# Altium schematic sheet Powersupply.SchDoc
size A3; SheetNumber: 3; SheetTotal: 7
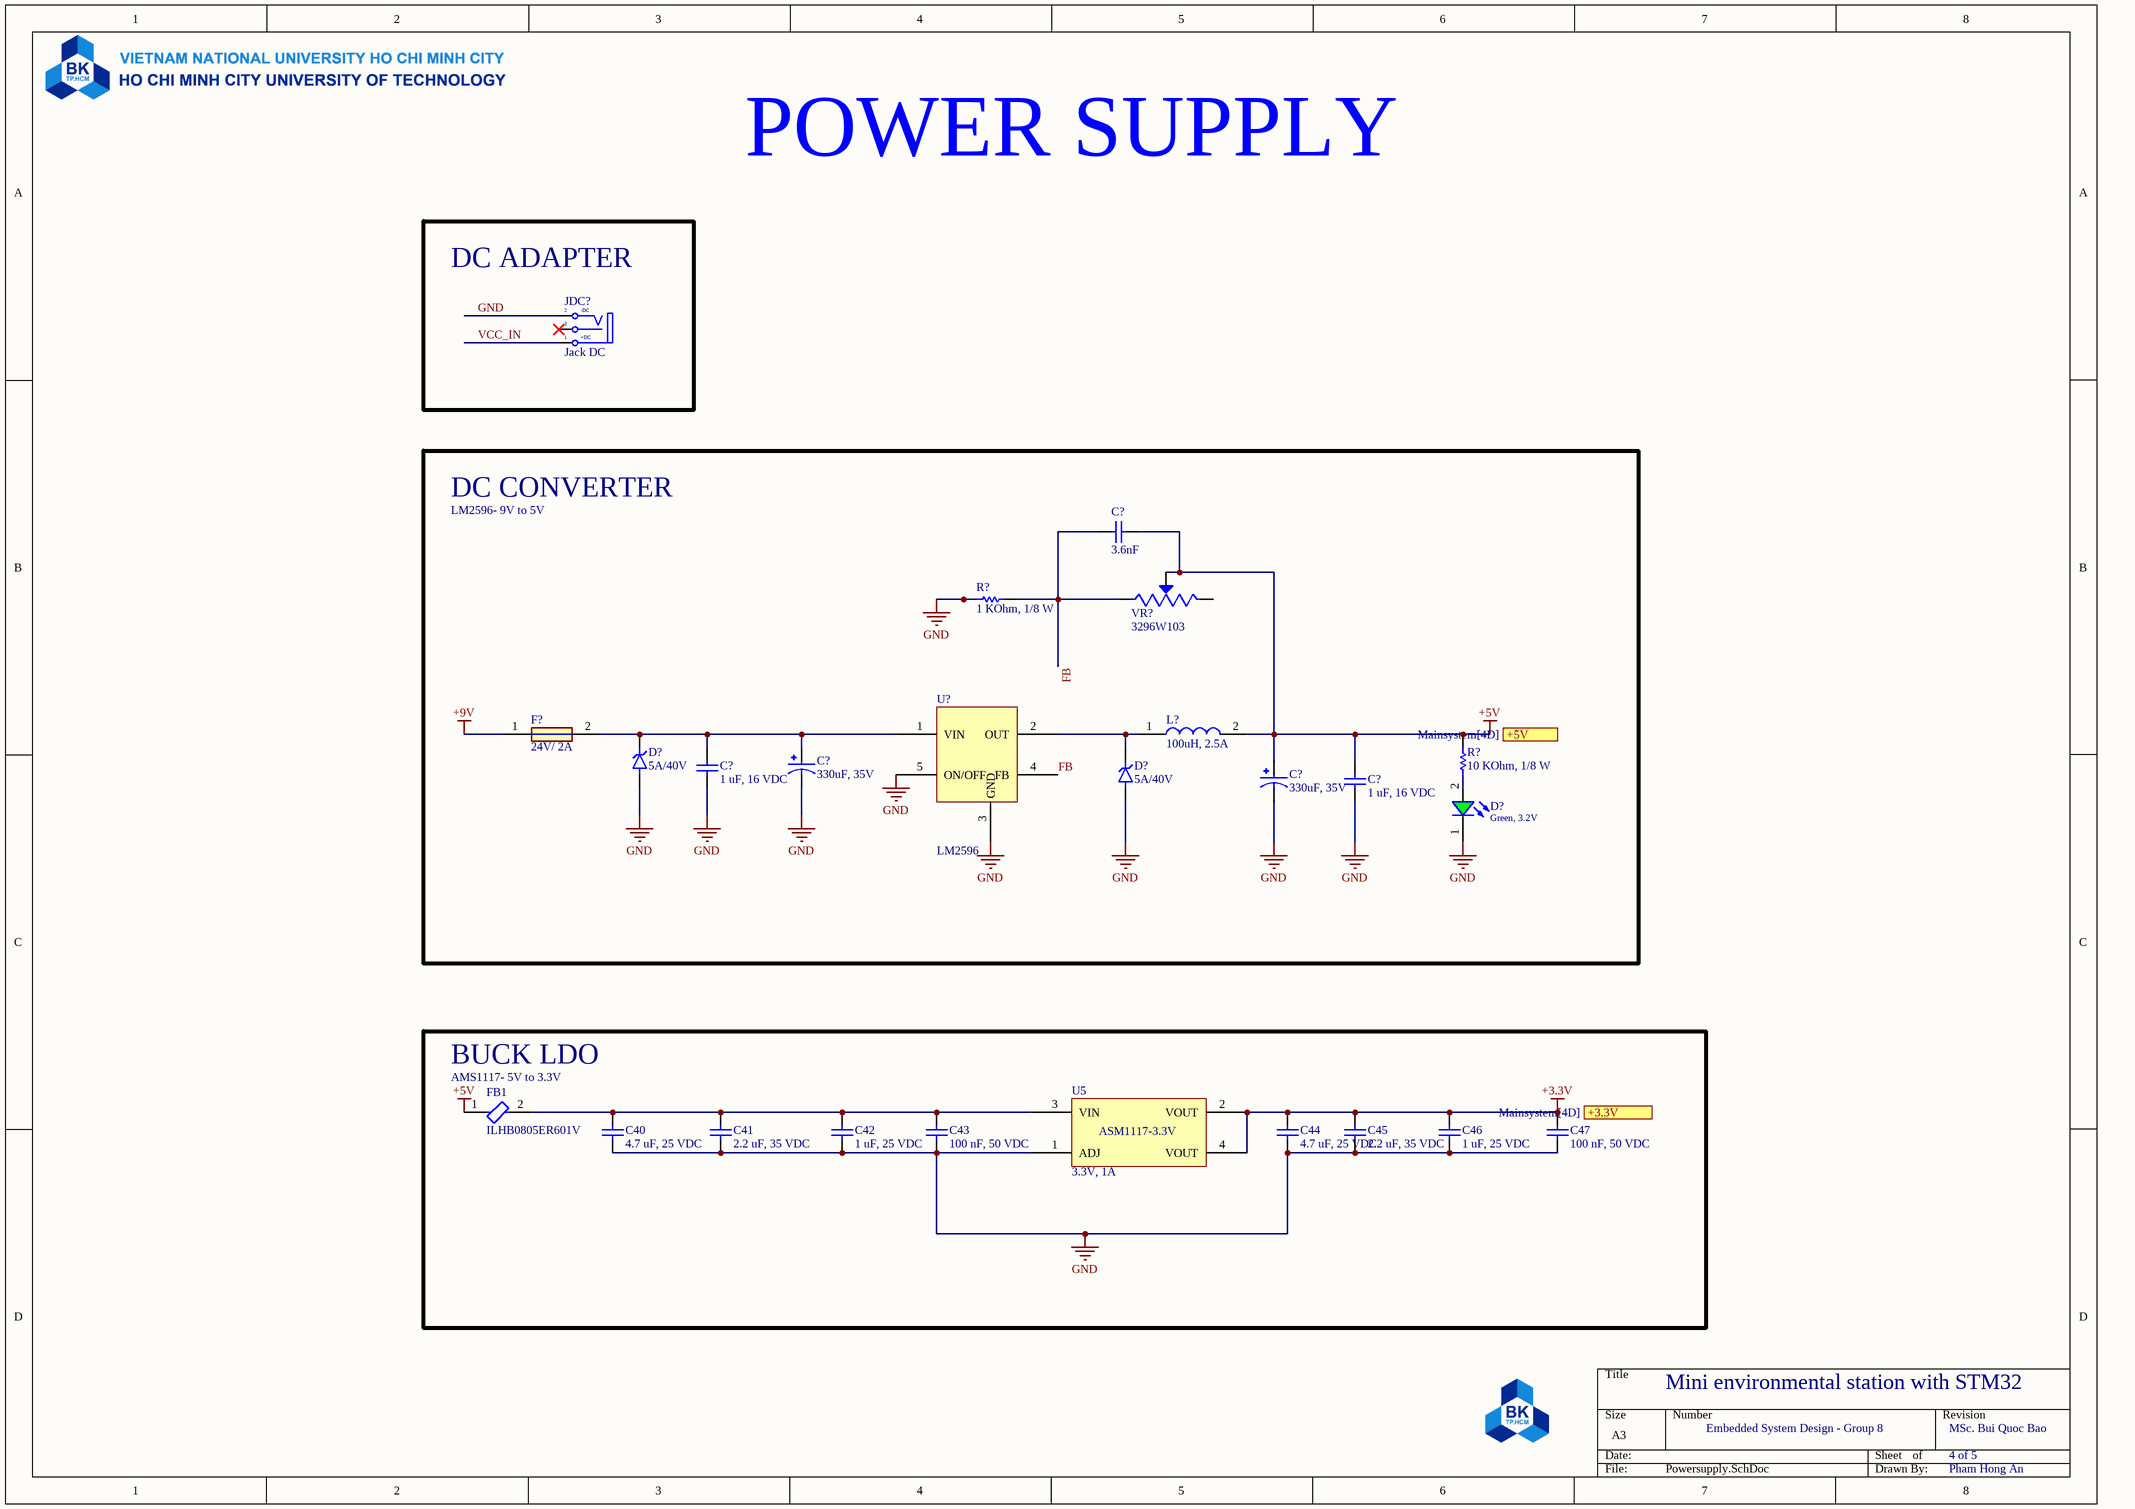
[diagram p0: Powersupply.SchDoc]

## Parts
(Parts that share a designator on the sheet are numbered #1, #2 ... from top to bottom, then left to right.)
C40  4.7 uF, 25 VDC  [CAP_0805]
C41  2.2 uF, 35 VDC  [CAP_0805]
C42  1 uF, 25 VDC  [CAP_0805]
C43  100 nF, 50 VDC  [CAP_0805]
C44  4.7 uF, 25 VDC  [CAP_0805]
C45  2.2 uF, 35 VDC  [CAP_0805]
C46  1 uF, 25 VDC  [CAP_0805]
C47  100 nF, 50 VDC  [CAP_0805]
C?#1  3.6nF  [CAP_0603]
C?#2  330uF, 35V  [CAP_EEEHA1E331P]
C?#3  330uF, 35V  [CAP_EEEHA1E331P]
C?#4  1 uF, 16 VDC  [CAP_0805]
C?#5  1 uF, 16 VDC  [CAP_0805]
D?#1  5A/40V  [DIOM4325X250N]
D?#2  5A/40V  [DIOM4325X250N]
D?#3  Green, 3.2V  [WL-SMCW_0805]
F?  24V/ 2A  [FUSC4632X85N]
FB1  ILHB0805ER601V  [FP-ILHB-0805-IPC_C]
JDC?  Jack DC  [DC-IN]
L?  100uH, 2.5A  [INDPM5656X320N]
R?#1  1 KOhm, 1/8 W  [RESISTOR_0805]
R?#2  10 KOhm, 1/8 W  [RESISTOR_0805]
U5  3.3V, 1A  [AMS1117-3.3V SOT223]
U?  LM2596  [LM2596]
VR?  3296W103  [TRIM_3296W103]

## Sub-sheets
BUCK LDO = AMS1117- 5V to 3.3V: no entries
DC ADAPTER = ?: no entries
DC CONVERTER = LM2596- 9V to 5V: no entries

## Ports
+3.3V (see Mainsystem[4D]), +5V (see Mainsystem[4D])

## Nets
+3.3V: C44.2 C45.2 C46.2 C47.2 U5.2(VOUT) U5.4(VOUT)
+5V: C?#1.2 C?#3.1 C?#5.2 FB1.1 L?.2 R?#2.2 VR?.2(WIPER)
+9V: F?.1
GND: C40.1 C41.1 C42.1 C43.1 C44.1 C45.1 C46.1 C47.1 C?#2.2 C?#3.2 C?#4.1 C?#5.1 D?#1.A D?#2.A D?#3.1(K) JDC?.2(TN) R?#1.1 U5.1(ADJ) U?.3(GND) U?.5(ON/OFF)
FB: C?#1.1 R?#1.2 U?.4(FB) VR?.1(CCW)
VCC_IN: JDC?.1(T)
NetC40_2: C40.2 C41.2 C42.2 C43.2 FB1.2 U5.3(VIN)
NetC?#2_1: C?#2.1 C?#4.2 D?#1.C(K) F?.2 U?.1(VIN)
NetD?#2_C: D?#2.C(K) L?.1 U?.2(OUT)
NetD?#3_2: D?#3.2(A) R?#2.1

Not connected (* = marked no-connect by the designer): JDC? 3(S)*; VR? 3(CW)

## Notes on the sheet
- POWER SUPPLY
- Mini environmental station with STM32
- Embedded System Design - Group 8
- MSc. Bui Quoc Bao
- 4 of 5
- Pham Hong An
- (in symbol AMS1117-3.3V) ASM1117-3.3V
- (in symbol CMP-002-00116-1) -DC; +DC

## Library data of the parts
C40 C44 = 0108054751025: CAP, size 0805, 4.7 uF, 25 VDC; Manufacture Name: TDK; Manufacture SN: CGA4J1X8L1E475K125AC; Capacitance: 4.7 uF; Tolerance: +/-10%; Voltage Rating DC: 25 VDC; ComponentLink2Description: Datasheet; ComponentLink2URL: https://product.tdk.com/system/files/dam/doc/product/capacitor/ceramic/mlcc/catalog/mlcc_automotive_hightemp_en.pdf?ref_disty=mouser; Operating Temperature: -55 to +125degC; Packaging: Tape and Reel; Mounting Technology: SMT; Size: 0805; Supplier 1 Name: Mouser; Supplier 1 SN: 810-CGA4J1X8L1E125AC; Supplier 1 URL: https://www.mouser.vn/ProductDetail/TDK/CGA4J1X8L1E475K125AC?qs=gZXFycFWdANxpKJOMQuJTA%3D%3D&utm_source=mouser-refine-download&utm_medium=file&utm_campaign=CGA4J1X8L1E475K125AC&utm_content=TDK; Supplier 2 Name: Digi-Key; Supplier 2 SN: 445-181605-2-ND; Supplier 2 URL: https://www.digikey.com/en/products/detail/tdk-corporation/cga4j1x8l1e475k125ac/9991390; Supplier 3 Name: thegioiic; Supplier 3 SN: OEM; Supplier 3 URL: N/A; Value: 4.7 uF, 25 VDC
C41 C45 = 0108052251035: CAP, size 0805, 2.2 uF, 35 VDC; Manufacture Name: TDK; Manufacture SN: CGA4J1X7R1V225K125AC; Capacitance: 2.2 uF; Tolerance: +/-10%; Voltage Rating DC: 35 VDC; ComponentLink2Description: Datasheet; ComponentLink2URL: https://product.tdk.com/system/files/dam/doc/product/capacitor/ceramic/mlcc/catalog/mlcc_automotive_general_en.pdf?ref_disty=mouser; Operating Temperature: -55 to +125degC; Packaging: Tape and Reel; Mounting Technology: SMT; Size: 0805; Supplier 1 Name: Mouser; Supplier 1 SN: 810-CGA4J1X7R1V225K; Supplier 1 URL: https://www.mouser.vn/ProductDetail/TDK/CGA4J1X7R1V225K125AC?qs=NRhsANhppD%2FTd0jz18r29g%3D%3D&utm_source=mouser-refine-download&utm_medium=file&utm_campaign=CGA4J1X7R1V225K125AC&utm_content=TDK; Supplier 2 Name: Digi-Key; Supplier 2 SN: 445-6963-2-ND; Supplier 2 URL: https://www.digikey.com/en/products/detail/tdk-corporation/cga4j1x7r1v225k125ac/2672856; Supplier 3 Name: thegioiic; Supplier 3 SN: OEM; Supplier 3 URL: N/A; Value: 2.2 uF, 35 VDC
C42 C46 = 0108051051025: CAP, size 0805, 1 uF, 25 VDC; Manufacture Name: TDK; Manufacture SN: CGA4J1X8R1E105K125AE; Capacitance: 1 uF; Tolerance: +/-10%; Voltage Rating DC: 25 VDC; ComponentLink2Description: Datasheet; ComponentLink2URL: https://product.tdk.com/system/files/dam/doc/product/capacitor/ceramic/mlcc/catalog/mlcc_automotive_soft_en.pdf?ref_disty=mouser; Operating Temperature: -55 to +125degC; Packaging: Tape and Reel; Mounting Technology: SMT; Size: 0805; Supplier 1 Name: Mouser; Supplier 1 SN: 810-A4J1X815K125AE; Supplier 1 URL: https://www.mouser.vn/ProductDetail/TDK/CGA4J1X8R1E105K125AE?qs=Ii670aiJhr6VRhkBsruYJg%3D%3D&utm_source=mouser-refine-download&utm_medium=file&utm_campaign=CGA4J1X8R1E105K125AE&utm_content=TDK; Supplier 2 Name: Digi-Key; Supplier 2 SN: 445-174807-2-ND; Supplier 2 URL: https://www.digikey.com/en/products/detail/tdk-corporation/cga4j1x8r1e105k125ae/6556490; Supplier 3 Name: thegioiic; Supplier 3 SN: OEM; Supplier 3 URL: N/A; Value: 1 uF, 25 VDC
C43 C47 = 0108051041050: CAP, size 0805, 100 nF, 50 VDC; Manufacture Name: TDK; Manufacture SN: CGA4J2X8R1H104K125AD; Capacitance: 0.1 nF; Tolerance: +/-10%; Voltage Rating DC: 50 VDC; Value: 0.1 nF, 50 VDC; ComponentLink2Description: Datasheet; ComponentLink2URL: https://product.tdk.com/system/files/dam/doc/product/capacitor/ceramic/mlcc/catalog/mlcc_automotive_epoxy_en.pdf?ref_disty=mouser; Operating Temperature: -55 to +125degC; Packaging: Tape and Reel; Mounting Technology: SMT; Size: 0805; Supplier 1 Name: Mouser; Supplier 1 SN: 810-C2012X8R1H104KEP; Supplier 1 URL: https://www.mouser.vn/ProductDetail/TDK/CGA4J2X8R1H104K125AD?qs=LcTL%2F5vFEzExqZqv3rh1qQ%3D%3D&utm_source=mouser-refine-download&utm_medium=file&utm_campaign=CGA4J2X8R1H104K125AD&utm_content=TDK; Supplier 2 Name: Digi-Key; Supplier 2 SN: 445-8810-2-ND; Supplier 2 URL: https://www.digikey.com/en/products/detail/tdk-corporation/cga4j2x8r1h104k125ad/3248169; Supplier 3 Name: thegioiic; Supplier 3 SN: OEM; Supplier 3 URL: N/A
C?#1 = 0106033320550: CAP, size 0603, 3.3 nF, 50 VDC; Manufacture Name: TDK; Manufacture SN: CGA3E2C0G1H332J080AE; Capacitance: 3.3 nF; Tolerance: +/-5%; Voltage Rating DC: 50 VDC; ComponentLink2Description: Datasheet; ComponentLink2URL: https://product.tdk.com/system/files/dam/doc/product/capacitor/ceramic/mlcc/catalog/mlcc_automotive_soft_en.pdf?ref_disty=mouser; Operating Temperature: -55 to +125degC; Packaging: Tape and Reel; Mounting Technology: SMT; Size: 0603; Supplier 1 Name: Mouser; Supplier 1 SN: 810-CGA3E2C0G1H332J8; Supplier 1 URL: https://www.mouser.com/ProductDetail/TDK/CGA3E2C0G1H332J080AE?qs=P1JMDcb91o59%252BuVOytSHFw%3D%3D&utm_source=mouser-refine-download&utm_medium=file&utm_campaign=CGA3E2C0G1H332J080AE&utm_content=TDK; Supplier 2 Name: Digi-Key; Supplier 2 SN: 445-CGA3E2C0G1H332J080AETR-ND; Supplier 2 URL: https://www.digikey.com/en/products/detail/tdk-corporation/cga3e2c0g1h332j080ae/11697916; Supplier 3 Name: thegioiic; Supplier 3 SN: N/A; Supplier 3 URL: N/A; Value: 3.3 nF, 50 VDC
C?#2 C?#3 = EEEHA1E331P: 330ÂµF 25V Aluminum Electrolytic Capacitors Radial, Can - SMD 1000 Hrs @ 105Â°C; MF: Panasonic; MP: EEE-HA1E331P; Check_prices: https://www.snapeda.com/parts/EEE-HA1E331P/Panasonic/view-part/?ref=eda; Purchase-URL: https://pricing.snapeda.com/search/part/EEE-HA1E331P/?ref=eda; Availability: In Stock; Price: None; Package: RADIAL-2 Panasonic; Value: *; SnapEDA_Link: https://www.snapeda.com/parts/EEE-HA1E331P/Panasonic/view-part/?ref=snap
C?#4 C?#5 = 0108051051016: CAP, size 0805, 1 uF, 16 VDC; Manufacture Name: TDK; Manufacture SN: CGA4J2X7R1C105K125AA; Capacitance: 1 uF; Tolerance: +/-10%; Voltage Rating DC: 16 VDC; ComponentLink2Description: Datasheet; ComponentLink2URL: https://product.tdk.com/system/files/dam/doc/product/capacitor/ceramic/mlcc/catalog/mlcc_automotive_general_en.pdf?ref_disty=mouser; Operating Temperature: -55 to +125degC; Packaging: Tape and Reel; Mounting Technology: SMT; Size: 0805; Supplier 1 Name: Mouser; Supplier 1 SN: 810-CGA4J2X7R1C105K; Supplier 1 URL: https://www.mouser.vn/ProductDetail/TDK/CGA4J2X7R1C105K125AA?qs=NRhsANhppD8sFjo%252B1TQuCQ%3D%3D&utm_source=mouser-refine-download&utm_medium=file&utm_campaign=CGA4J2X7R1C105K125AA&utm_content=TDK; Supplier 2 Name: Digi-Key; Supplier 2 SN: 445-5689-2-ND; Supplier 2 URL: https://www.digikey.com/en/products/detail/tdk-corporation/cga4j2x7r1c105k125aa/2443167; Supplier 3 Name: thegioiic; Supplier 3 SN: OEM; Supplier 3 URL: N/A; Value: 1 uF, 16 VDC
D?#1 D?#2 = 1SMA5932H: Price: None; Availability: Unavailable; Value: *; MP: 1SMA5932H; Package: None
D?#3 = 160805GreenBlur: WL-SMCW SMT Mono-color Chip LED Blur, size 0805, Green, 3.2V, 140deg; Color: Green; Size: 0603; Type: Blur; ComponentLink1Description: Datasheet link; ComponentLink1URL: N/A; ComponentLink2Description: Supplier 1 URL; ComponentLink2URL: https://www.mouser.vn/ProductDetail/Broadcom-Avago/HSMG-C170?qs=YDL0qNrpDT4lm8ArMPkMEA%3D%3D; ComponentLink3Description: Supplier 2 URL; ComponentLink3URL: SML-LXT0805GW-TR Lumex Opto/Components Inc. | Optoelectronics | DigiKey; ComponentLink4Description: Supplier 3 URL; ComponentLink4URL: N/A; Supplier 1 Name: Mouser; Supplier 1 SN: 630-HSMG-C170; Supplier 1 URL: https://www.mouser.vn/ProductDetail/Broadcom-Avago/HSMG-C170?qs=YDL0qNrpDT4lm8ArMPkMEA%3D%3D; Supplier 2 Name: Digi-Key; Supplier 2 SN: 67-1553-2-ND; Supplier 2 URL: SML-LXT0805GW-TR Lumex Opto/Components Inc. | Optoelectronics | DigiKey; Supplier 3 Name: ICDayRoi; Supplier 3 SN: N/A; Supplier 3 URL: N/A; Value: Green, 3.2V
F? = MF-MSMF075_24-2: Fuse; Manufacturer_Name: Bourns; Manufacturer_Part_Number: MF-MSMF075/24-2; Datasheet Link: https://componentsearchengine.com/Datasheets/2/MF-MSMF075_24-2.pdf; Height: 0.85mm; Mouser Part Number: 652-MF-MSMF075/24-2; Mouser Price/Stock: https://www.mouser.co.uk/ProductDetail/Bourns/MF-MSMF075-24-2?qs=4wQOTo1SlKkr8xXCy%2FQ4UA%3D%3D; Arrow Part Number: MF-MSMF075/24-2; Arrow Price/Stock: https://www.arrow.com/en/products/mf-msmf07524-2/bourns?region=nac
FB1 = CMP-02428-000001-1: FERRITE BEAD 600 OHM 0805 1LN; Manufacturer: Vishay; Tolerance: 25%; Shielding: true; Test Frequency: 100MHz; Impedance At Frequency: 600Ω @ 100MHz; Series Resistance: 0.1Ω; Rms Current: 2000mA; ComponentLink2URL: http://www.vishay.com/docs/34102/ilhb.pdf; Octopart: https://octopart.com/ilhb0805er601v-vishay-39650184; Automotive: No; Height: 1.1mm; Mouser Description: Ferrite Beads Multi-Layer High Current 600Ohm 25% 100MHz 2A 100mOhm DCR 0805 T/R; ComponentLink2Description: Datasheet; Device Class L2: EMI / RFI Components; Lead Free: Yes; Ipc Land Pattern Name: CAPC200125X90; Package: ILHB-0805; Manufacturer Part Number: ILHB0805ER601V; Device Class L1: Passive Components; Digikey Description: FERRITE BEAD 600 OHM 0805 1LN; Category: FBead; Temperature Range High: +125°C; Temperature: -55°C to +125°C; RoHS: TRUE; Temperature Range Low: -55°C; Device Class L3: Ferrite Beads and Chips
JDC? = CMP-002-00116-1: Jack DC input; Value: Jac DC; Pins: 3; Component Type: Standard; Design Item ID: Jack DC; Source: PIF_Schematic_Lib.SchLib
L? = RMMX110-5D28: Inductor; Manufacturer_Name: Souriau; Datasheet Link: https://www.arrow.com/en/products/rmmx110-5d28/souriau; Height: 3.2mm; Manufacturer_Part_Number: RMMX110-5D28
R?#1 = 0008051021: RES, size 0805, 1 KOhm, 1/8 W; Manufacture  Name: Vishay Dale; Manufacture  SN: M55342K06B1E00RS3; Resistance tolerance: +/-1%; Rated Power: 1/8 W; Resistance: 1 KOhm; Size: 0805; Mounting Technology: SMT; Supplier 1 Name: Mouser; Supplier 1 SN: N/A; Supplier 1 URL: N/A; Supplier 2 Name: Digi-Key; Supplier 2 SN: 1135-1001-2-ND; Supplier 2 URL: https://www.digikey.com/en/products/detail/vishay-dale/M55342K06B1E00RS3/2941798; Supplier 3 Name: Thegioiic; Supplier 3 SN: N/A; Supplier 3 URL: https://www.thegioiic.com/dien-tro-1-kohm-0805-1; Value: 1 KOhm, 1/8 W; ComponentLink1Description: Datasheet link; ComponentLink1URL: https://www.vishay.com/docs/31010/rcwpm.pdf; ComponentLink2Description: Supplier 1 URL; ComponentLink2URL: N/A; ComponentLink3Description: Supplier 2 URL; ComponentLink3URL: https://www.digikey.com/en/products/detail/vishay-dale/M55342K06B1E00RS3/2941798; ComponentLink4Description: Supplier 3 URL; ComponentLink4URL: https://www.thegioiic.com/dien-tro-1-kohm-0805-1
R?#2 = 0008051035: RES, size 0805, 10 KOhm, 1/8 W; Manufacture  Name: Vishay Dale; Manufacture  SN: CRCW080510K0JNEAC; Resistance tolerance: +/-5%; Rated Power: 1/8 W; Resistance: 10 KOhm; Size: 0805; Mounting Technology: SMT; Supplier 1 Name: Mouser; Supplier 1 SN: 71-CRCW080510K0JNEB; Supplier 1 URL: https://www.mouser.vn/ProductDetail/Vishay-Dale/CRCW080510K0JNEB?qs=LOX6nxTstiZ5fn9YUdHx5A%3D%3D; Supplier 2 Name: Digi-Key; Supplier 2 SN: 541-4163-2-ND; Supplier 2 URL: https://www.digikey.com/en/products/detail/vishay-dale/CRCW080510K0JNEAC/7928585; Supplier 3 Name: Thegioiic; Supplier 3 SN: N/A; Supplier 3 URL: N/A; Value: 10 KOhm, 1/8 W; ComponentLink1Description: Datasheet link; ComponentLink1URL: https://www.vishay.com/docs/28773/crcwce3.pdf; ComponentLink2Description: Supplier 1 URL; ComponentLink2URL: https://www.mouser.vn/ProductDetail/Vishay-Dale/CRCW080510K0JNEB?qs=LOX6nxTstiZ5fn9YUdHx5A%3D%3D; ComponentLink3Description: Supplier 2 URL; ComponentLink3URL: https://www.digikey.com/en/products/detail/vishay-dale/CRCW080510K0JNEAC/7928585; ComponentLink4Description: Supplier 3 URL; ComponentLink4URL: N/A
U5 = AMS1117-3.3V: AMS1117-3.3V, OUT 3.3V 1A.; Manufacturer: AMS; Pad Count: 4; Voltage Input Maximum: 15V; Manufacturer Part Number: N/A; Current Input Maximum: N/A; Current Output Maximum: 1A; Supplier 1 Name: Mouser; Supplier 2 Name: Digi-Key; Supplier 3 Name: thegioiic; Voltage Output: 3.3V; Mounting Technology: SMD; ComponentLink1Description: Datasheet link; ComponentLink1URL: http://www.advanced-monolithic.com/pdf/ds1117.pdf; ComponentLink2Description: Supplier 1 URL; ComponentLink2URL: N/A; ComponentLink3Description: Supplier 2 URL; ComponentLink3URL: N/A; ComponentLink4Description: Supplier 3 URL; ComponentLink4URL: N/A; Supplier 1 SN: N/A; Supplier 1 URL: N/A; Supplier 2 SN: N/A; Supplier 2 URL: N/A; Supplier 3 SN: N/A; Supplier 3 URL: https://www.thegioiic.com/ams1117-3-3v-ic-on-ap-3-3v-1a-sot-223; Value: 3.3V, 1A
VR? = 3296W103: MF: Bourns; SnapEDA_Link: https://www.snapeda.com/parts/3296W103/Bourns/view-part/?ref=snap; Package: NON STANDARD-3 Bourns; Value: *; MP: 3296W103; Check_prices: https://www.snapeda.com/parts/3296W103/Bourns/view-part/?ref=eda